# Altium schematic sheet NRC7394-RX.SchDoc: ESP-RX
size C; SheetNumber: 3; SheetTotal: 9; SPICEModelCacheFYEGEFDL: <root> / <DocumentId>FYEGEFDL</DocumentId> / </root>
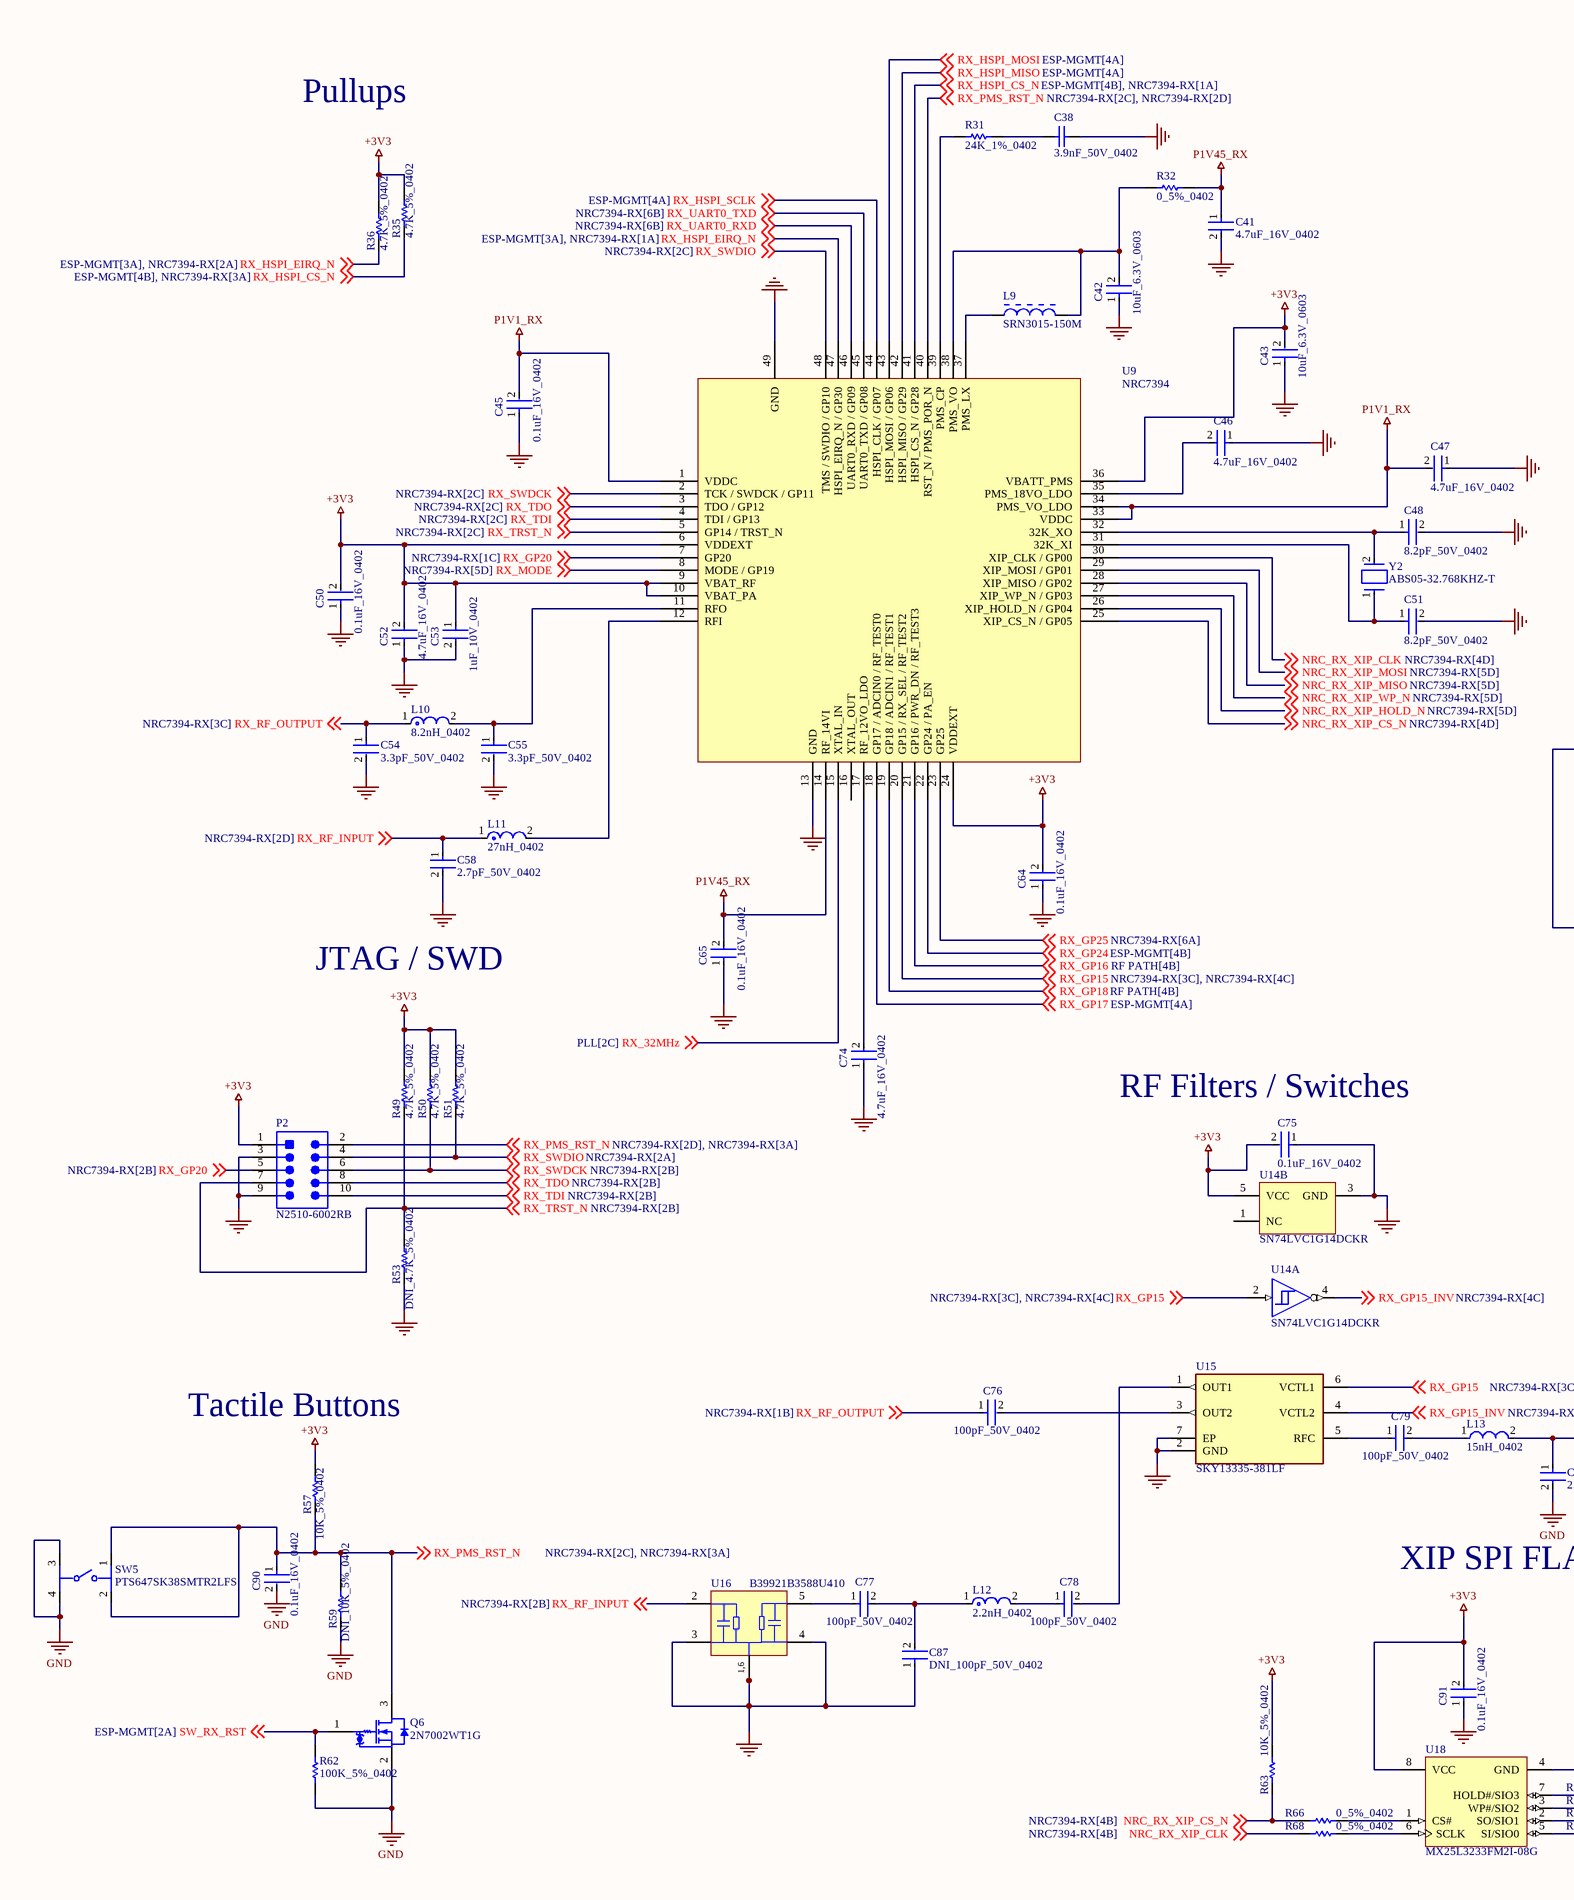
[diagram p0: NRC7394-RX.SchDoc, left]
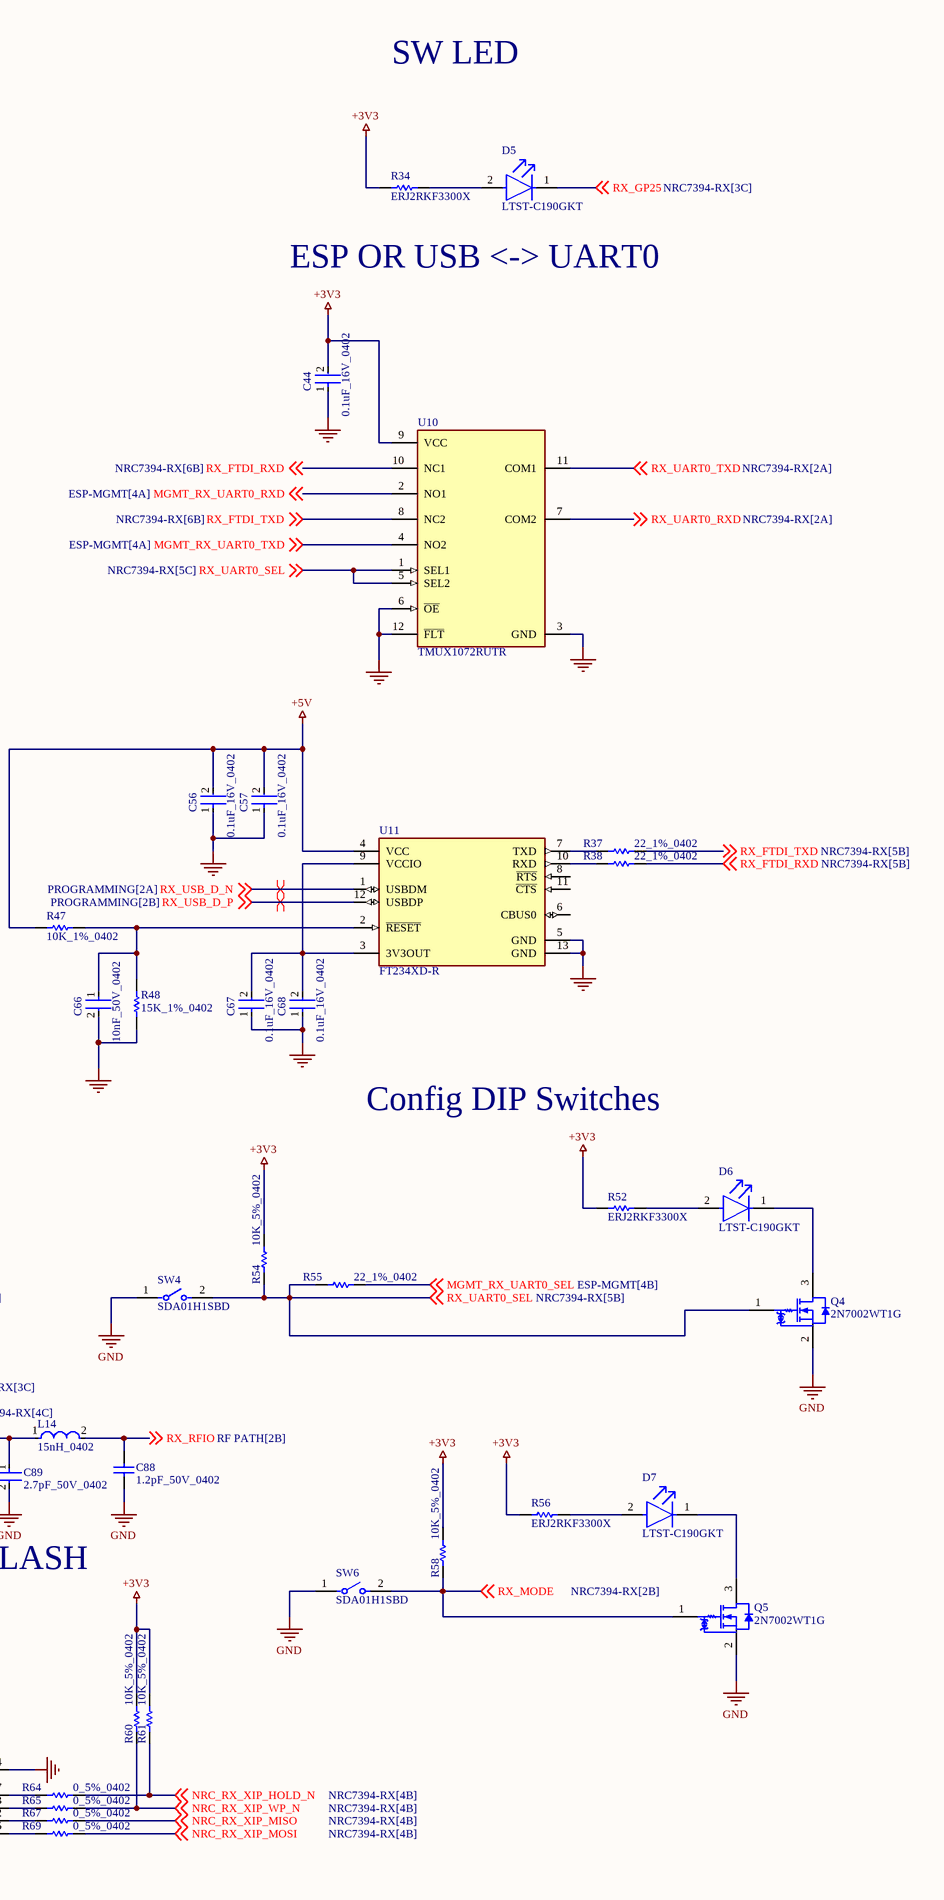
[diagram p1: NRC7394-RX.SchDoc, right]

## Parts
C38  3.9nF_50V_0402  [CAPC1005X56X25LL10T15]
C41  4.7uF_16V_0402  [FP-CL829-IPC_C]
C42  10uF_6.3V_0603  [FP-GRM188-0_1-e0_2_0_55-IPC_A]
C43  10uF_6.3V_0603  [FP-GRM188-0_1-e0_2_0_55-IPC_A]
C44  0.1uF_16V_0402  [FP-C0402-BB-MFG]
C45  0.1uF_16V_0402  [FP-C0402-BB-MFG]
C46  4.7uF_16V_0402  [FP-CL829-IPC_C]
C47  4.7uF_16V_0402  [FP-CL829-IPC_C]
C48  8.2pF_50V_0402  [FP-C0402-BB-MFG]
C50  0.1uF_16V_0402  [FP-C0402-BB-MFG]
C51  8.2pF_50V_0402  [FP-C0402-BB-MFG]
C52  4.7uF_16V_0402  [FP-CL829-IPC_C]
C53  1uF_10V_0402  [FP-C0402C105K8PACTU-MFG]
C54  3.3pF_50V_0402  [FP-C0402-BB-MFG]
C55  3.3pF_50V_0402  [FP-C0402-BB-MFG]
C56  0.1uF_16V_0402  [FP-C0402-BB-MFG]
C57  0.1uF_16V_0402  [FP-C0402-BB-MFG]
C58  2.7pF_50V_0402  [FP-GJM155-0_05-IPC_A]
C64  0.1uF_16V_0402  [FP-C0402-BB-MFG]
C65  0.1uF_16V_0402  [FP-C0402-BB-MFG]
C66  10nF_50V_0402  [FP-CL165-IPC_C]
C67  0.1uF_16V_0402  [FP-C0402-BB-MFG]
C68  0.1uF_16V_0402  [FP-C0402-BB-MFG]
C74  4.7uF_16V_0402  [FP-CL829-IPC_C]
C75  0.1uF_16V_0402  [FP-C0402-BB-MFG]
C76  100pF_50V_0402  [FP-C0402-BB-MFG]
C77  100pF_50V_0402  [FP-C0402-BB-MFG]
C78  100pF_50V_0402  [FP-C0402-BB-MFG]
C79  100pF_50V_0402  [FP-C0402-BB-MFG]
C87  DNI_100pF_50V_0402  [FP-C0402-BB-MFG]  (no BOM)
C88  1.2pF_50V_0402  [CAPC1006X50X20LL10T10]
C89  2.7pF_50V_0402  [FP-GJM155-0_05-IPC_A]
C90  0.1uF_16V_0402  [FP-C0402-BB-MFG]
C91  0.1uF_16V_0402  [FP-C0402-BB-MFG]
D5  LTST-C190GKT  [FP-LTST-C190GKT-MFG]
D6  LTST-C190GKT  [FP-LTST-C190GKT-MFG]
D7  LTST-C190GKT  [FP-LTST-C190GKT-MFG]
L9  SRN3015-150M  [BOUR-SRN3015-2_V]
L10  8.2nH_0402  [FP-LQG15HH_02-IPC_B]
L11  27nH_0402  [FP-LQG15HH_02-IPC_C]
L12  2.2nH_0402  [FP-LQG15HH_02-IPC_C]
L13  15nH_0402  [FP-HK1005-MFG]
L14  15nH_0402  [FP-HK1005-MFG]
P2  N2510-6002RB  [3M-N2510-6002-10_V]
Q4  2N7002WT1G  [ONSC-SC-70-3-419-04_V]
Q5  2N7002WT1G  [ONSC-SC-70-3-419-04_V]
Q6  2N7002WT1G  [ONSC-SC-70-3-419-04_V]
R31  24K_1%_0402  [RESC1005X40X25ML05T05]
R32  0_5%_0402  [RESC1005X40X25ML05T10]
R34  ERJ2RKF3300X  [RESC1005X40X25ML05T05]
R35  4.7K_5%_0402  [RESC1005X40X25LL05T05]
R36  4.7K_5%_0402  [RESC1005X40X25LL05T05]
R37  22_1%_0402  [RESC1005X40X25LL05T10]
R38  22_1%_0402  [RESC1005X40X25LL05T10]
R47  10K_1%_0402  [RESC1005X40X25NL05T10]
R48  15K_1%_0402  [RESC1005X40X25ML05T10]
R49  4.7K_5%_0402  [RESC1005X40X25LL05T05]
R50  4.7K_5%_0402  [RESC1005X40X25LL05T05]
R51  4.7K_5%_0402  [RESC1005X40X25LL05T05]
R52  ERJ2RKF3300X  [RESC1005X40X25ML05T05]
R53  DNI_4.7K_5%_0402  [RESC1005X40X25LL05T05]  (no BOM)
R54  10K_5%_0402  [RESC1005X40X25ML05T05]
R55  22_1%_0402  [RESC1005X40X25LL05T10]
R56  ERJ2RKF3300X  [RESC1005X40X25ML05T05]
R57  10K_5%_0402  [RESC1005X40X25ML05T05]
R58  10K_5%_0402  [RESC1005X40X25ML05T05]
R59  DNI_10K_5%_0402  [RESC1005X40X25ML05T05]  (no BOM)
R60  10K_5%_0402  [RESC1005X40X25ML05T05]
R61  10K_5%_0402  [RESC1005X40X25ML05T05]
R62  100K_5%_0402  [RESC1005X37X25ML05T10]
R63  10K_5%_0402  [RESC1005X40X25ML05T05]
R64  0_5%_0402  [RESC1005X40X25ML05T10]
R65  0_5%_0402  [RESC1005X40X25ML05T10]
R66  0_5%_0402  [RESC1005X40X25ML05T10]
R67  0_5%_0402  [RESC1005X40X25ML05T10]
R68  0_5%_0402  [RESC1005X40X25ML05T10]
R69  0_5%_0402  [RESC1005X40X25ML05T10]
SW4  SDA01H1SBD  [FP-SDA01H1SBD-MFG]
SW5  PTS647SK38SMTR2LFS  [FP-PTS647SK38SMTR2LFS-MFG]
SW6  SDA01H1SBD  [FP-SDA01H1SBD-MFG]
U9  NRC7394  [QFN48_6X6]
U10  TMUX1072RUTR  [FP-RUT0012A-MFG]
U11  FT234XD-R  [FP-DFN-12-IPC_B]
U14  SN74LVC1G14DCKR  [DCK0005A_L]  (parts A,B of 2)
U15  SKY13335-381LF  [FP-SKY13335-381LF-MFG]
U16  B39921B3588U410  [EPCO-DCC6C-6]
U18  MX25L3233FM2I-08G  [MXIC-SOP-8_M]
Y2  ABS05-32.768KHZ-T  [FP-ABS05-MFG]

## Nets
+3V3: C43.2 C44.2 C50.2 C52.2 C53.1 C64.2 C75.2 C91.2 P2.1 R34.1 R35.2 R36.2 R49.2 R50.2 R51.2 R52.1 R54.2 R56.1 R57.2 R58.2 R60.2 R61.2 R63.2 U9.6(VDDEXT) U9.9(VBAT_RF) U9.10(VBAT_PA) U9.24(VDDEXT) U9.36(VBATT_PMS) U10.9(VCC) U14.5(VCC) U18.8(VCC)
+5V: C56.2 C57.2 R47.1 U11.4(VCC)
GND: C38.2 C41.2 C42.1 C43.1 C44.1 C45.1 C46.1 C47.1 C48.2 C50.1 C51.2 C52.1 C53.2 C54.2 C55.2 C56.1 C57.1 C58.2 C64.1 C65.1 C66.2 C67.1 C68.1 C74.1 C75.1 C87.1 C88.1 C89.2 C90.2 C91.1 P2.3 P2.9 Q4.2(S) Q5.2(S) Q6.2(S) R48.1 R53.1 R59.1 R62.1 SW4.1 SW5.3 SW5.4 SW6.1 U9.13(GND) U9.49(GND) U10.3(GND) U10.6(~{OE}) U10.12(~{FLT}) U11.5(GND) U11.13(GND) U14.3(GND) U15.2(GND) U15.7(EP) U16.1(GND) U16.3(GND) U16.4(GND) U16.6(GND) U18.4(GND)
P1V1_RX: C45.2 C47.2 U9.1(VDDC) U9.33(VDDC) U9.34(PMS_VO_LDO)
P1V45_RX: C41.1 C65.2 R32.2 U9.14(RF_14VI)
MGMT_RX_UART0_RXD: U10.2(NO1) ; off-sheet MGMT_RX_UART0_RXD
MGMT_RX_UART0_SEL: R55.2 ; off-sheet MGMT_RX_UART0_SEL
MGMT_RX_UART0_TXD: U10.4(NO2) ; off-sheet MGMT_RX_UART0_TXD
NRC_RX_XIP_CLK: R68.1 U9.30(XIP_CLK_/_GP00) ; off-sheet NRC_RX_XIP_CLK
NRC_RX_XIP_CS_N: R63.1 R66.1 U9.25(XIP_CS_N_/_GP05) ; off-sheet NRC_RX_XIP_CS_N
NRC_RX_XIP_HOLD_N: R61.1 R64.2 U9.26(XIP_HOLD_N_/_GP04) ; off-sheet NRC_RX_XIP_HOLD_N
NRC_RX_XIP_MISO: R67.2 U9.28(XIP_MISO_/_GP02) ; off-sheet NRC_RX_XIP_MISO
NRC_RX_XIP_MOSI: R69.2 U9.29(XIP_MOSI_/_GP01) ; off-sheet NRC_RX_XIP_MOSI
NRC_RX_XIP_WP_N: R60.1 R65.2 U9.27(XIP_WP_N_/_GP03) ; off-sheet NRC_RX_XIP_WP_N
RX_32MHz: U9.15(XTAL_IN) ; off-sheet RX_32MHz
RX_FTDI_RXD: R38.2 U10.10(NC1) ; off-sheet RX_FTDI_RXD
RX_FTDI_TXD: R37.2 U10.8(NC2) ; off-sheet RX_FTDI_TXD
RX_GP15: U9.20(GP15_/_RX_SEL_/_RF_TEST2) U14.2(A) U15.6(VCTL1) ; off-sheet RX_GP15
RX_GP15_INV: U14.4(Y) U15.4(VCTL2) ; off-sheet RX_GP15_INV
RX_GP16: U9.21(GP16_/_PWR_DN_/_RF_TEST3) ; off-sheet RX_GP16
RX_GP17: U9.18(GP17_/_ADCIN0_/_RF_TEST0) ; off-sheet RX_GP17
RX_GP18: U9.19(GP18_/_ADCIN1_/_RF_TEST1) ; off-sheet RX_GP18
RX_GP20: P2.5 U9.7(GP20) ; off-sheet RX_GP20
RX_GP24: U9.22(GP24_/_PA_EN) ; off-sheet RX_GP24
RX_GP25: D5.1(C) U9.23(GP25) ; off-sheet RX_GP25
RX_HSPI_CS_N: R35.1 U9.41(HSPI_CS_N_/_GP28) ; off-sheet RX_HSPI_CS_N
RX_HSPI_EIRQ_N: R36.1 U9.47(HSPI_EIRQ_N_/_GP30) ; off-sheet RX_HSPI_EIRQ_N
RX_HSPI_MISO: U9.42(HSPI_MISO_/_GP29) ; off-sheet RX_HSPI_MISO
RX_HSPI_MOSI: U9.43(HSPI_MOSI_/_GP06) ; off-sheet RX_HSPI_MOSI
RX_HSPI_SCLK: U9.44(HSPI_CLK_/_GP07) ; off-sheet RX_HSPI_SCLK
RX_MODE: Q5.1(G) R58.1 SW6.2 U9.8(MODE_/_GP19) ; off-sheet RX_MODE
RX_PMS_RST_N: C90.1 P2.2 Q6.3(D) R57.1 R59.2 SW5.1 SW5.2 U9.40(RST_N_/_PMS_POR_N) ; off-sheet RX_PMS_RST_N
RX_RF_INPUT: C58.1 L11.1 U16.2(INPUT) ; off-sheet RX_RF_INPUT
RX_RF_OUTPUT: C54.1 C76.1 L10.1 ; off-sheet RX_RF_OUTPUT
RX_RFIO: C88.2 L14.2 ; off-sheet RX_RFIO
RX_SWDCK: P2.6 R50.1 U9.2(TCK_/_SWDCK_/_GP11) ; off-sheet RX_SWDCK
RX_SWDIO: P2.4 R51.1 U9.48(TMS_/_SWDIO_/_GP10) ; off-sheet RX_SWDIO
RX_TDI: P2.10 U9.4(TDI_/_GP13) ; off-sheet RX_TDI
RX_TDO: P2.8 U9.3(TDO_/_GP12) ; off-sheet RX_TDO
RX_TRST_N: P2.7 R49.1 R53.2 U9.5(GP14_/_TRST_N) ; off-sheet RX_TRST_N
RX_UART0_RXD: U9.46(UART0_RXD_/_GP09) U10.7(COM2) ; off-sheet RX_UART0_RXD
RX_UART0_SEL: Q4.1(G) R54.1 R55.1 SW4.2 U10.1(SEL1) U10.5(SEL2) ; off-sheet RX_UART0_SEL
RX_UART0_TXD: U9.45(UART0_TXD_/_GP08) U10.11(COM1) ; off-sheet RX_UART0_TXD
RX_USB_D_N: U11.1(USBDM) ; off-sheet RX_USB_D_N
RX_USB_D_P: U11.12(USBDP) ; off-sheet RX_USB_D_P
SW_RX_RST: Q6.1(G) R62.2 ; off-sheet SW_RX_RST
NetC38_1: C38.1 R31.2
NetC42_2: C42.2 L9.2 R32.1 U9.38(PMS_VO)
NetC46_2: C46.2 U9.35(PMS_18VO_LDO)
NetC48_1: C48.1 U9.32(32K_XO) Y2.2
NetC51_1: C51.1 U9.31(32K_XI) Y2.1
NetC55_1: C55.1 L10.2 U9.11(RFO)
NetC66_1: C66.1 R47.2 R48.2 U11.2(~{RESET})
NetC67_2: C67.2 C68.2 U11.3(3V3OUT) U11.9(VCCIO)
NetC74_2: C74.2 U9.17(RF_12VO_LDO)
NetC76_2: C76.2 U15.3(OUT2)
NetC77_1: C77.1 U16.5(OUTPUT)
NetC77_2: C77.2 C87.2 L12.1
NetC78_1: C78.1 L12.2
NetC78_2: C78.2 U15.1(OUT1)
NetC79_1: C79.1 U15.5(RFC)
NetC79_2: C79.2 L13.1
NetC89_1: C89.1 L13.2 L14.1
NetD5_2: D5.2(A) R34.2
NetD6_1: D6.1(C) Q4.3(D)
NetD6_2: D6.2(A) R52.2
NetD7_1: D7.1(C) Q5.3(D)
NetD7_2: D7.2(A) R56.2
NetL9_1: L9.1 U9.37(PMS_LX)
NetL11_2: L11.2 U9.12(RFI)
NetR31_1: R31.1 U9.39(PMS_CP)
NetR37_1: R37.1 U11.7(TXD)
NetR38_1: R38.1 U11.10(RXD)
NetR64_1: R64.1 U18.7(HOLD#/SIO3)
NetR65_1: R65.1 U18.3(WP#/SIO2)
NetR66_2: R66.2 U18.1(CS#)
NetR67_1: R67.1 U18.2(SO/SIO1)
NetR68_2: R68.2 U18.6(SCLK)
NetR69_1: R69.1 U18.5(SI/SIO0)

Not connected (* = marked no-connect by the designer): U9 16(XTAL_OUT); U11 6(CBUS0) 8(~{RTS}) 11(~{CTS}); U14 1(NC)

## Layout directives
differential pair: RX_USB_D_N, RX_USB_D_P

## Notes on the sheet
- SW LED
- Pullups
- ESP OR USB <-> UART0
- JTAG / SWD
- (near C75) RF Filters / Switches
- Config DIP Switches
- Tactile Buttons
- XIP SPI FLASH
- (in symbol CMP-2000-05901-1) 1,6

## Library data of the parts
C38 = CMP-2008-02725-1: Manufacturer: AVX Interconnect / Elco; Part Number: 04025C392JAT2A
C41 C46 C47 C52 C74 = CMP-13271-001468-1: Cap Ceramic 4.7uF 16V X5R ±20% SMD 0402 +85°C Paper T/R; Mount: Surface Mount; Case Code (Metric): 1005; Case/Package: 0402; Length: 0.039inch; Capacitance: 4.7uF; Voltage Rating: 16V; Max Operating Temperature: 85°C; Tolerance: 20%; Thickness: 0.022inch; Min Operating Temperature: -55°C; Case Code (Imperial): 0402; Packaging: Tape and Reel; Width: 0.02inch
C42 C43 = CMP-2006-02792-2: Chip Multilayer Ceramic Capacitors for General Purpose, 0603, 10uF, X5R, 15%, 20%, 6.3V; Packaging: Tape and Reel; Voltage Rating (DC): 6.3V; Width: 0.031inch; Termination: SMD/SMT; Dielectric: X5R; Package Quantity: 4000; Voltage Rating: 6.3V; Capacitance: 10uF; Case/Package: 0603; Min Operating Temperature: -55°C; Voltage: 6.3V; Length: 1.6mm; Thickness: 0.035inch; Lead Free: Lead Free; Depth: 0.8mm; Case Code (Imperial): 0603; Max Operating Temperature: 85°C; Material: Ceramic; Height: 0.8mm; Tolerance: 20%; Mount: Surface Mount; REACH SVHC: No SVHC; Radiation Hardening: No; Case Code (Metric): 1608
C44 C45 C50 C56 C57 C64 C65 C67 C68 C75 C90 C91 = CMP-2008-02094-2: CAP CER 0.1UF 16V 20% X7R 0402; Manufacturer: Kemet; Manufacturer Part Number: C0402C104M4RACTU; Temperature Coefficient: 15%; Material: Ceramic; Capacitance: 0.10 μF; Tolerance: 0.2; Value: 0.10 μF; Temperature Range High: +125°C; Device Class L3: Ceramic Capacitors; Category: Cap; RoHS: TRUE; ComponentLink2URL: https://content.kemet.com/datasheets/KEM_C1002_X7R_SMD.pdf; Temperature: -55°C to +125°C; Octopart: https://octopart.com/c0402c104m4ractu-kemet-10476575; Automotive: No; Height: 0.55mm; ComponentLink2Description: Datasheet; Device Class L2: Capacitors; Voltage Rating: 16 V; Device Class L1: Passive Components; Temperature Characteristic: X7R; Lead Free: Yes; Digikey Description: CAP CER 0.1UF 16V 20% X7R 0402; Mouser Description: Multilayer Ceramic Capacitors MLCC - SMD/SMT 16volts 0.1uF X7R 20%; Temperature Range Low: -55°C; Ipc Land Pattern Name: CAPC10050X50; Package: C0402-BB
C48 C51 = CMP-1034-00608-3: CAP CER 8.2PF 50V NP0 0402; Manufacturer Part Number: C0402C829C5GACTU; Manufacturer: Kemet; Tolerance: 0.25 pF; Temperature Coefficient: 15%; Temperature Characteristic: C0G; Material: Ceramic; Temperature Range Low: -55°C; Height: 0.55mm; ComponentLink2URL: https://content.kemet.com/datasheets/KEM_C1002_X7R_SMD.pdf; Ipc Land Pattern Name: CAPC10050X50; Temperature: -55°C to +125°C; Lead Free: Yes; RoHS: TRUE; Category: Cap; ComponentLink2Description: Datasheet; Voltage Rating: 50 V; Package: C0402-BB; Capacitance: 8.2 pF; Digikey Description: CAP CER 8.2PF 50V NP0 0402; Device Class L3: Ceramic Capacitors; Mouser Description: Multilayer Ceramic Capacitors MLCC - SMD/SMT 50volts 8.2pF C0G .25pF; Device Class L2: Capacitors; Octopart: https://octopart.com/c0402c829c5gactu-kemet-9144065; Temperature Range High: +125°C; Automotive: No; Device Class L1: Passive Components; Value: 8.2 pF
C53 = CMP-2008-02081-2: CAP CER 1UF 10V X5R 0402; Dielectric Material: Ceramic; Dissipation Factor: 5%; Tolerance: 10%; Number of Pins: 2; Contact Plating: Tin; Min Operating Temperature: -55°C; Termination: SMD/SMT; Lead Free: Lead Free; Construction: Flat; Voltage Rating (DC): 10V; Mount: Surface Mount; Series: C; Thickness: 0.022inch; Width: 0.5mm; Radiation Hardening: No; Capacitance: 1uF; Dielectric: X5R; Height: 0.5mm; Voltage: 10V; Length: 1mm; Depth: 0.5mm; Max Operating Temperature: 85°C; Package Quantity: 1; Packaging: Tape and Reel; RoHS Compliant: Yes; Case Code (Imperial): 0402; Case Code (Metric): 1005; REACH SVHC: No SVHC; Voltage Rating: 10V; Case/Package: 0402
C54 C55 = CMP-2008-03312-2: Capacitor: ceramic; MLCC; 3.3pF; 50VDC; C0G; ±0.25pF; SMD; 0402; Manufacturer Part Number: C0402C339C5GACTU; Manufacturer: Kemet; Temperature Coefficient: 15%; Voltage Rating: 50 V; RoHS: TRUE; Material: Ceramic; Capacitance: 3.3 pF; Value: 3.3 pF; Height: 0.55mm; Temperature: -55°C to +125°C; Package: C0402-BB; Mouser Description: Multilayer Ceramic Capacitors MLCC - SMD/SMT 50volts 3.3pF C0G .25pF; Category: Cap; ComponentLink2Description: Datasheet; Device Class L1: Passive Components; Tolerance: 0.25 pF; Temperature Characteristic: C0G; ComponentLink2URL: https://content.kemet.com/datasheets/KEM_C1002_X7R_SMD.pdf; Device Class L2: Capacitors; Temperature Range High: +125°C; Digikey Description: Capacitor: ceramic; MLCC; 3.3pF; 50VDC; C0G; ±0.25pF; SMD; 0402; Lead Free: Yes; Ipc Land Pattern Name: CAPC10050X50; Octopart: https://octopart.com/c0402c339c5gactu-kemet-105751; Automotive: No; Device Class L3: Ceramic Capacitors; Temperature Range Low: -55°C
C58 C89 = CMP-2008-03840-2: Multi-Layer Ceramic Capacitor 2.7pF C0G  ±0.1pF 0402 Paper T/R; Voltage Rating (DC): 50V; Temperature Coefficient: 30ppm/°C; Max Operating Temperature: 125°C; Lead Free: Lead Free; REACH SVHC: No SVHC; Thickness: 0.022inch; Length: 1mm; Height: 0.5mm; Min Operating Temperature: -55°C; Mount: Surface Mount; Case/Package: 0402; Case Code (Imperial): 0402; Width: 0.02inch; Capacitance: 2.7pF; Packaging: Tape and Reel; Package Quantity: 10000; Lead Pitch: 0.3mm; Dielectric: C0G; Depth: 0.5mm; Voltage Rating: 50V; Radiation Hardening: No; Termination: SMD/SMT; Voltage: 50V; Number of Pins: 2; Case Code (Metric): 1005
C66 = CMP-13271-000387-1: Cap Ceramic 10nF 50V X7R ±10% SMD 0402 +125°C Paper T/R; Depth: 0.5mm; Length: 1mm; Lead Free: Lead Free; Case Code (Metric): 1005; Width: 0.02inch; Min Operating Temperature: -55°C; Thickness: 0.022inch; Package Quantity: 1; Mount: Surface Mount; Height: 0.5mm; Voltage: 50V; Material: Ceramic; Tolerance: 10%; Case Code (Imperial): 0402; Radiation Hardening: No; Case/Package: 0402; Max Operating Temperature: 125°C; Voltage Rating (DC): 50V; Contact Plating: Tin; Packaging: Tape and Reel; Voltage Rating: 50V; Capacitance: 10nF; Dielectric: X7R
C76-C79 C87 = CMP-2008-03284-2: CAP CER 100PF 50V C0G/NP0 0402; Manufacturer: Kemet; Manufacturer Part Number: C0402C101J5GACTU; Tolerance: 0.05; Temperature Characteristic: C0G; Temperature Coefficient: 15%; Material: Ceramic; Digikey Description: CAP CER 100PF 50V C0G/NP0 0402; Lead Free: Yes; Capacitance: 100 pF; Device Class L3: Ceramic Capacitors; Mouser Description: Multilayer Ceramic Capacitors MLCC - SMD/SMT 50volts 100pF C0G 5%; Octopart: https://octopart.com/c0402c101j5gactu-kemet-132471; Temperature Range Low: -55°C; Value: 100 pF; Automotive: No; Height: 0.55mm; Category: Cap; ComponentLink2URL: https://content.kemet.com/datasheets/KEM_C1002_X7R_SMD.pdf; RoHS: TRUE; Ipc Land Pattern Name: CAPC10050X50; Temperature Range High: +125°C; Device Class L2: Capacitors; Package: C0402-BB; ComponentLink2Description: Datasheet; Temperature: -55°C to +125°C; Voltage Rating: 50 V; Device Class L1: Passive Components
C88 = CMP-2008-04752-1: Manufacturer: AVX Interconnect / Elco; Part Number: 04023J1R2BBSTR
D5-D7 = CMP-22017-000005-2: LED GREEN CLEAR CHIP SMD; Dominant Wavelength: 569nm; Reverse Voltage: 5V; Lens Color: Colorless; Viewing Angle: 130°; Voltage: 2V; Forward Current: 30mA; Power Dissipation: 100mW; Luminous Intensity: 6mcd; Number of LEDs: 1; Forward Voltage: 2.1V; Wavelength: 565nm; Test Current: 10mA; Min Operating Temperature: -55°C; Lens Style: Clear; Mount: Surface Mount; Width: 0.8mm; Packaging: Tape and Reel; Lens Transparency: Clear; Case Code (Metric): 1608; Depth: 0.8mm; Case Code (Imperial): 0603; Case/Package: 0603; Number of Pins: 2; Max Operating Temperature: 85°C; Lead Free: Lead Free; Number of Elements: 1; Length: 1.6mm; Height: 0.8mm; Package Quantity: 1; Power Rating: 100mW; Radiation Hardening: No; Illumination Color: Green; Color: Green
L9 = CMP-0007-00012-1: Semi-shielded Power Inductor, 15 uH, +/- 20%, 0.8 A, -40 to 125 degC, 3 x 3 x 1.5 mm SMD, RoHS and Halogen Free, Tape and Reel; Manufacturer: Bourns; Isat: 0.68 A; Resistance to Solder Heat: +260 degC for 10 sec.; Inductance tolerance: +/- 20%; Rated current: 0.8 A; DCR Max: 0.422 Ohm; SRF Min: 33 MHz; Inductance: 15 uH; ComponentLink3Description: Package Specification; ComponentLink2URL: http://www.bourns.com/data/global/pdfs/SRN3015.pdf; Mounting Technology: Surface Mount; Operating Temperature: -40 to 125 degC; PartNumber: SRN3015-150M; ComponentLink1URL: http://www.bourns.com/; PackageReference: SRN3015; ComponentLink1Description: Manufacturer URL; PackageDescription: 2-Pin SMD, Body 3 x 3 mm, Height 1.5 mm; Packing: Tape and Reel; RoHS: TRUE; ComponentLink2Description: Datasheet; DatasheetVersion: Aug-11; ComponentLink3URL: http://www.bourns.com/data/global/pdfs/SRN3015.pdf
L10 = CMP-06042-007420-1: Multilayer type RF Inductor 8.2nH ±5% 0.24Ω 550mA 0402; Current Rating: 300mA; Test Frequency: 100MHz; Shielding: Unshielded; Self Resonant Frequency: 3.7GHz; Core Material: Air; DC Resistance (DCR): 240mR; Q Factor: 8; Package Quantity: 10000; Lead Free: Lead Free; Case Code (Imperial): 0402; Width: 0.02inch; Height: 0.5mm; Inductance: 8.2nH; Height - Seated (Max): 0.022inch; Depth: 0.55mm; Termination: SMD/SMT; Packaging: Tape and Reel; DC Current: 300mA; Tolerance: 5%; Case/Package: 0402; Mount: Surface Mount; Max Operating Temperature: 125°C; Max DC Current: 300mA; Case Code (Metric): 1005; Radiation Hardening: No; Military Standard: Not; Length: 1mm; Weight: 2.3E-05oz; Min Operating Temperature: -55°C
L11 = CMP-2000-06578-2: Multilayer type RF Inductor 27nH ±5% 0.46Ω 350mA 0402; DC Current: 300mA; Core Material: Air; Self Resonant Frequency: 1.7GHz; Q Factor: 8; DC Resistance (DCR): 460mR; Shielding: Unshielded; Test Frequency: 100MHz; Inductance: 27nH; Width: 0.02inch; Length: 1mm; Height - Seated (Max): 0.022inch; Military Standard: Not; Case Code (Imperial): 0402; Tolerance: 5%; Depth: 0.55mm; Current Rating: 300mA; Inductance Tolerance: 5%; Lead Free: Lead Free; Height: 0.5mm; Max DC Current: 300mA; REACH SVHC: No SVHC; Package Quantity: 10000; Mount: Surface Mount; Termination: SMD/SMT; Case Code (Metric): 1005; Case/Package: 0402; Max Operating Temperature: 125°C; Packaging: Tape and Reel; Min Operating Temperature: -55°C
L12 = CMP-1662-00024-2: Multilayer type RF Inductor 2.2nH ±0.3nH 0.09Ω 900mA 0402; Test Frequency: 100MHz; Core Material: Air; DC Resistance (DCR): 150mR; Q Factor: 8; Shielding: Unshielded; Self Resonant Frequency: 6GHz; Current Rating: 300mA; Lead Free: Lead Free; Military Standard: Not; Case Code (Imperial): 0402; Case Code (Metric): 1005; Min Operating Temperature: -55°C; Width: 0.02inch; Depth: 0.55mm; Length: 1mm; REACH SVHC: No SVHC; Height - Seated (Max): 0.022inch; Case/Package: 0402; Inductance: 2.2nH; Height: 0.02inch; Package Quantity: 10000; Packaging: Tape and Reel; Mount: Surface Mount; Max DC Current: 300mA; Number of Pins: 2; Max Operating Temperature: 125°C; Termination: SMD/SMT; DC Current: 300mA; Radiation Hardening: No
L13 L14 = CMP-14484-000027-1: FIXED IND 15NH 320MA 460 MOHM; Self Resonant Frequency: 2.3GHz; DC Resistance (DCR): 460mR; Inductance Tolerance: 5%; Test Frequency: 100MHz; Shielding: Unshielded; Body Material: Ceramic; Core Material: Ferrite; Max DC Current: 300mA; Q Factor: 8; Case/Package: 0402; Radiation Hardening: No; Mount: Surface Mount; Military Standard: Not; Lead Free: Exempt; Length: 0.039inch; Min Operating Temperature: -55°C; Max Operating Temperature: 125°C; Package Quantity: 10000; Height - Seated (Max): 0.022inch; Inductance: 15nH; Case Code (Imperial): 0402; Depth: 0.55mm; Case Code (Metric): 1005; DC Current: 320mA; Width: 0.02inch; Termination: SMD/SMT; Halogen Free: Halogen Free; Current Rating: 320mA; Height: 0.5mm; Number of Pins: 2; Series: HK; Tolerance: 5%; Packaging: Tape and Reel; RoHS Compliant: Yes
P2 = CMP-2000-06794-1: Male Header, Pitch 2.54 mm, 2 x 5 Postion, Height 9.91 mm, Tail Length 2.84 mm, -55 to 105 degC, RoHS, Bulk; PartNumber: N2510; Manufacturer: 3M; Package Version: Rev. M, 08/2014; Rad Hard: No; No. of Rows: 2; Number of Contacts: 10; Pitch: 2.54mm; Termination Method: Solder; Manufacturer URL: http://www.3m.com/; Package Description: 10-Pin Through Hole Device, Body 20.02 x 8.59 mm, Pitch 2.54 mm; Gender: Male; Number of Rows: 2; Orientation: Straight; Contact Plating: GoldOverNickel; Packaging: Rail/Tube; Mounting Technology: ThroughHole; Datasheet URL: https://datasheet.ciiva.com/11746/0900766b807b18da-11746957.pdf; Package Reference: N2510-6002-10; Datasheet Version: 05/2007; No. of Positions: 10; Package URL: http://multimedia.3m.com/mws/media/330367O/3mtm-100-in-4-wall-hdr-rohs-lp-straightra-hitemp-ts0770.pdf; Type: ShroudedHeader
Q4-Q6 = CMP-1058-00618-1: Small Signal MOSFET, 60 V, 340 mA, Single, N-Channel, 3-Pin SC70, Pb-Free, Tape and Reel; Manufacturer: On Semiconductor; Crss Typ (pF): 2.2; Coss Typ (pF): 4.2; VGS(th) Max (V): 2.5; Channel Polarity: N Channel; ID Max (A): 0.34; VGS Max (V): 20; V(BR)DSS Min (V): 60; Ciss Typ (pF): 24.5; Configuration: Single; Packing: Tape and Reel; Package Type: SC-70-3 / SOT-323-3; RoHS: Pb-Free; ComponentLink3Description: Package Specification; PackageReference: SC-70-3-419-04; Mounting Technology: Surface Mount; PackageVersion: Rev. N, 11/2008; ComponentLink2URL: http://www.onsemi.com/pub_link/Collateral/2N7002W-D.PDF; PartNumber: 2N7002WT1G; ComponentLink2Description: Datasheet; ComponentLink3URL: http://www.onsemi.cn/pub_link/Collateral/419-04.PDF; ComponentLink1Description: Manufacturer URL; ComponentLink1URL: http://www.onsemi.com/; DatasheetVersion: Rev. 5; PackageDescription: 3-Pin Small Outline Transistor, Body 2 x 1.25 mm, Pitch 0.65 mm
R31 = CMP-2002-08403-1: Part Number: CRCW040224K0FKED; Manufacturer: Vishay Dale
R32 R64-R69 = CMP-2002-06457-1: Manufacturer: Panasonic; Part Number: ERJ-U020R00X
R34 R52 R56 = CMP-2002-01143-1: Manufacturer: Panasonic; Part Number: ERJ2RKF3300X
R35 R36 R49-R51 R53 = CMP-1011-00090-2: Part Number: CRCW04024K70JNTD; Manufacturer: Vishay Dale
R37 R38 R55 = CMP-2002-07520-1: Manufacturer: Yageo / Phycomp; Part Number: RC0402FR-0722RL
R47 = CMP-2002-06487-1: Manufacturer: Multicomp; Part Number: MCMR04X103 JTL
R48 = CMP-2002-08068-1: Manufacturer: Yageo; Part Number: RC0402JR-1315KL
R54 R57-R61 R63 = CMP-2002-01181-1: Manufacturer: Panasonic; Part Number: ERT-J0EM103J
R62 = CMP-2002-01850-1: Part Number: RE0402DR-07100KL; Manufacturer: Yageo / Phycomp
SW4 SW6 = CMP-10033-000001-1: SWITCH SLIDE DIP SPST 25MA 24V; Manufacturer: C&K Components; Electromechanical Life: 1000Cycles; Contact Resistance: 50mΩ; Standoff Height: 0.037inch; Number Of Circuits: 1; Throw Configuration: SPST; Temperature Range High: +85°C; ComponentLink2Description: Datasheet; Manufacturer Part Number: SDA01H1SBD; Contact Current Rating: 25mA; Mouser Description: DIP Switches / SIP Switches 1 Pos SPST SMT SDA Series DIP SW; Digikey Description: SWITCH SLIDE DIP SPST 25MA 24V; RoHS: TRUE; Device Class L2: Switches; Octopart: https://octopart.com/sda01h1sbd-c%26k+components-7089741; Temperature: -40°C to +85°C; Automotive: No; Package: SDA01H1SBD; Height: 0.214inch; Device Class L1: Electromechanical; Category: Switch; Device Class L3: DIP Switches; Lead Free: Yes; Voltage Rating Dc: 24V; Temperature Range Low: -40°C; ComponentLink2URL: https://www.ckswitches.com/media/1327/sda.pdf
SW5 = CMP-10040-000033-1: TACT 4.5 X 4.5, 3.8 MM H, 2.5N,; Switch Function: Off-Mom; Switch Travel: 0.25mm; Actuator Type: Standard; Illumination Type: Non-Illuminated; Mechanical Life: 100000Cycles; Ratings: IP40; Operating Force: 250gf; Throw Configuration: SPST; Max Operating Temperature: 70°C; Min Operating Temperature: -20°C; Termination: Gull Wing; Mount: Surface Mount; Packaging: Tape and Reel
U9 = NRC7394: NRC7394 WiFi HaLow chipset
U10 = CMP-04892-000114-1: IC SWITCH SPDT DUAL 12UQFN; Number of Circuits: 2; -3db Bandwidth: 1.2GHz; On-State Resistance: 18R; Number of Pins: 12; Min Operating Temperature: -40°C; RoHS Compliant: Yes; Max Operating Temperature: 125°C; Number of Channels: 2; Packaging: Tape and Reel
U11 = CMP-0248-00027-3: IC USB SERIAL BASIC UART 12DFN; Min Supply Voltage: 2.97V; Number of Ports: 1; Operating Supply Voltage: 5V; Operating Supply Current: 8mA; Max Supply Voltage: 5.5V; Data Rate: 3Mbps; Length: 3mm; Case/Package: DFN; Mount: Surface Mount; Packaging: Tape and Reel; Max Operating Temperature: 85°C; Height: 0.75mm; Number of Pins: 12; Number of Transceivers: 1; Package Quantity: 5000; Min Operating Temperature: -40°C; Width: 3mm; REACH SVHC: No SVHC; Interface: UART; Lead Free: Lead Free
U14 = CMP-0859-00440-4: Single Schmitt-Trigger Inverter, DCK0005A, LARGE T&R; Manufacturer: Texas Instruments; Output Drive (IOL/IOH)(Max)(mA): 32/-32; Schmitt Trigger: Yes; Logic: Inverting; Bits(#): 1; Rating: Catalog; tpd @ Nom Voltage(Max)(ns): 11,6.5,5.5,5; Voltage(Nom)(V): 1.8,2.5,3.3,5; Output Type: CMOS; VCC(Min)(V): 1.65; ICC @ Nom Voltage(Max)(mA): 0.01; Input Type: CMOS/TTL; F @ Nom Voltage(Max)(Mhz): 150; VCC(Max)(V): 5.5; Sub-Family: Inverting Buffer/Driver; 3-State Output: No; Technology Family: LVC; PackageReference: DCK0005A; Operating Temperature Range(C): -40 to 125,-40 to 85; Generic Part Number: SN74LVC1G14; DatasheetVersion: SCES218W
U15 = CMP-85923-000005-1: IC RF SWITCH SPDT 6GHZ 6MLPD; Insertion Loss: 0.5dB; Turn-Off Delay Time: 50ns; P1dB: 26dBm; IIP3: 41dBm; Impedance: 50R; Number of Switches: 1; Operating Frequency: 100 MHz to 6 GHz; Throw Configuration: SPDT; Frequency: 6GHz; Number of Pins: 6; Turn-On Delay Time: 50ns; Package Quantity: 3000; Min Operating Temperature: -40°C; RoHS Compliant: Yes; Series: -; Radiation Hardening: No; Lead Free: Lead Free; Max Operating Temperature: 85°C; Packaging: Tape and Reel; Case/Package: QFN
U16 = CMP-2000-05901-1: SAW RF Filter, 915 MHz, -45 to 125 degC, 6-Pin SMD, RoHS, Tape and Reel; Manufacturer: EPCOS; No. of Pins: 6; SVHC: ToBeAdvised; Pass Band Frequency: 902MHzto928MHz; SAW Filter Applications: RemoteControlReceivers; Center Frequency: 915MHz; Mounting Technology: SurfaceMount; Datasheet Version: Rev. 2.3, 08/2008; Package Reference: DCC6C; Package Description: 6-Pin Surface Mount Device, Body 3 x 3 mm, Pitch 1.2 mm; Manufacturer URL: https://en.tdk.eu/; Datasheet URL: https://datasheet.ciiva.com/1127/1598293-1127012.pdf; Filter Case Style: SMD
U18 = CMP-2000-05278-1: CMOS MXSMIO(R) (Serial Multi I/O) Flash Memory, 32 Mbits (x1/x2/x4), 3 V, -40 to 85 degC, 8-Pin SOP; Manufacturer: Macronix; Manufacturer URL: http://www.macronix.com; Package Description: 8-Pin Small Outline Package, Body 5.23 x 5.28 mm, Pitch 1.27 mm; Datasheet URL: http://datasheet.octopart.com/MX25L3233FM2I-08G-Macronix-datasheet-38883555.pdf; Datasheet Version: Rev. 1.1, 01/2015; Package Reference: SOP-8
Y2 = CMP-27762-008890-2: Crystal 32.768kHz ±20ppm (Tol) 12.5pF FUND 90kΩ 2-Pin SMD T/R; Series Resistance: 90kR; Length: 1.6mm; Package Quantity: 3000; Packaging: Tape and Reel; Max Operating Temperature: 85°C; Lead Free: Lead Free; Tolerance: 20ppm; Frequency: 32.768kHz; Termination: SMD/SMT; REACH SVHC: No SVHC; Width: 1mm; Min Operating Temperature: -40°C; RoHS Compliant: Yes; Case/Package: CSMD; ESR (Equivalent Series Resistance): 90kR; Number of Pins: 2; Height: 0.5mm; Series: ABS05; Load Capacitance: 12.5pF; Frequency Tolerance: 20ppm; Depth: 1mm; Operating Frequency: 32.768 kHz; Mount: Surface Mount; Radiation Hardening: No